# Altium schematic sheet Sheet3.SchDoc
size 420 x 297 mm; SheetNumber: 2; SheetTotal: 2; Razrabotal: {Разработал}; Prov: {Проверил}; Tkont: {Т. конт.}; Nkont: {Н. конт.}; Utv: {Утвердил}; Naimenovanie: {Наименование}; Oboznachenie: {Обозначение}; Shifr: {Шифр}
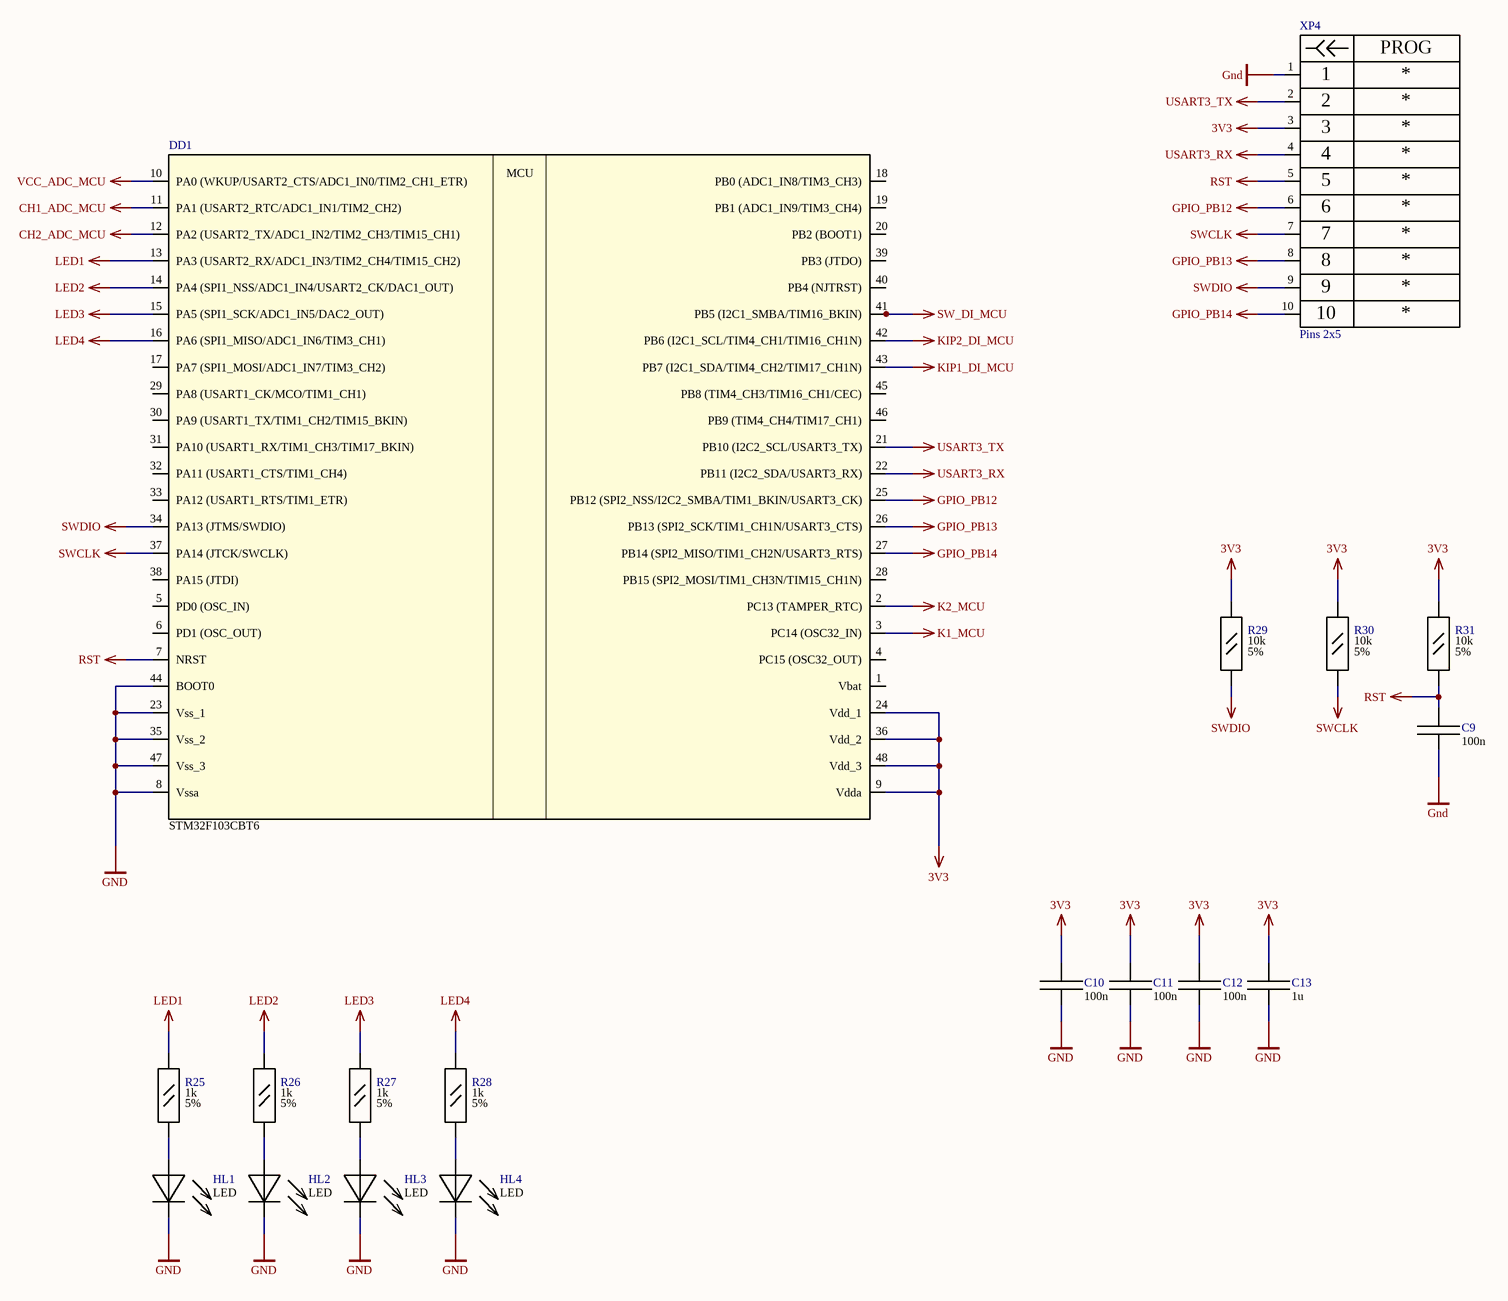
[diagram p0: Sheet3.SchDoc]

## Parts
C9  100n  [Cap Ceramic 0805]
C10  100n  [Cap Ceramic 0805]
C11  100n  [Cap Ceramic 0805]
C12  100n  [Cap Ceramic 0805]
C13  1u  [Cap Ceramic 0805]
DD1  STM32F103CBT6  [TQFP48/QFN48 S0.5]
HL1  LED  [LED S2.54d3.0]
HL2  LED  [LED S2.54d3.0]
HL3  LED  [LED S2.54d3.0]
HL4  LED  [LED S2.54d3.0]
R25  1k  Comments: 5%  [Resistor 0805]
R26  1k  Comments: 5%  [Resistor 0805]
R27  1k  Comments: 5%  [Resistor 0805]
R28  1k  Comments: 5%  [Resistor 0805]
R29  10k  Comments: 5%  [Resistor 0805]
R30  10k  Comments: 5%  [Resistor 0805]
R31  10k  Comments: 5%  [Resistor 0805]
XP4  Pins 2x5  Name: PROG  [Pins 2x5 - 1.27]

## Nets
3V3: C10.2 C11.2 C12.2 C13.2 DD1.9(Vdda) DD1.24(Vdd_1) DD1.36(Vdd_2) DD1.48(Vdd_3) R29.1 R30.1 R31.1 XP4.3
CH1_ADC_MCU: DD1.11(PA1_(USART2_RTC/ADC1_IN1/TIM2_CH2))
CH2_ADC_MCU: DD1.12(PA2_(USART2_TX/ADC1_IN2/TIM2_CH3/TIM15_CH1))
GND: C9.1 C10.1 C11.1 C12.1 C13.1 DD1.8(Vssa) DD1.23(Vss_1) DD1.35(Vss_2) DD1.44(BOOT0) DD1.47(Vss_3) HL1.2(K) HL2.2(K) HL3.2(K) HL4.2(K) XP4.1
GPIO_PB12: DD1.25(PB12_(SPI2_NSS/I2C2_SMBA/TIM1_BKIN/USART3_CK)) XP4.6
GPIO_PB13: DD1.26(PB13_(SPI2_SCK/TIM1_CH1N/USART3_CTS)) XP4.8
GPIO_PB14: DD1.27(PB14_(SPI2_MISO/TIM1_CH2N/USART3_RTS)) XP4.10
K1_MCU: DD1.3(PC14_(OSC32_IN))
K2_MCU: DD1.2(PC13_(TAMPER_RTC))
KIP1_DI_MCU: DD1.43(PB7_(I2C1_SDA/TIM4_CH2/TIM17_CH1N))
KIP2_DI_MCU: DD1.42(PB6_(I2C1_SCL/TIM4_CH1/TIM16_CH1N))
LED1: DD1.13(PA3_(USART2_RX/ADC1_IN3/TIM2_CH4/TIM15_CH2)) R25.1
LED2: DD1.14(PA4_(SPI1_NSS/ADC1_IN4/USART2_CK/DAC1_OUT)) R26.1
LED3: DD1.15(PA5_(SPI1_SCK/ADC1_IN5/DAC2_OUT)) R27.1
LED4: DD1.16(PA6_(SPI1_MISO/ADC1_IN6/TIM3_CH1)) R28.1
RST: C9.2 DD1.7(NRST) R31.2 XP4.5
SW_DI_MCU: DD1.41(PB5_(I2C1_SMBA/TIM16_BKIN))
SWCLK: DD1.37(PA14_(JTCK/SWCLK)) R30.2 XP4.7
SWDIO: DD1.34(PA13_(JTMS/SWDIO)) R29.2 XP4.9
USART3_RX: DD1.22(PB11_(I2C2_SDA/USART3_RX)) XP4.4
USART3_TX: DD1.21(PB10_(I2C2_SCL/USART3_TX)) XP4.2
VCC_ADC_MCU: DD1.10(PA0_(WKUP/USART2_CTS/ADC1_IN0/TIM2_CH1_ETR))
NetHL1_1: HL1.1(A) R25.2
NetHL2_1: HL2.1(A) R26.2
NetHL3_1: HL3.1(A) R27.2
NetHL4_1: HL4.1(A) R28.2

Not connected (* = marked no-connect by the designer): DD1 1(Vbat) 4(PC15_(OSC32_OUT)) 5(PD0_(OSC_IN)) 6(PD1_(OSC_OUT)) 17(PA7_(SPI1_MOSI/ADC1_IN7/TIM3_CH2)) 18(PB0_(ADC1_IN8/TIM3_CH3)) 19(PB1_(ADC1_IN9/TIM3_CH4)) 20(PB2_(BOOT1)) 28(PB15_(SPI2_MOSI/TIM1_CH3N/TIM15_CH1N)) 29(PA8_(USART1_CK/MCO/TIM1_CH1)) 30(PA9_(USART1_TX/TIM1_CH2/TIM15_BKIN)) 31(PA10_(USART1_RX/TIM1_CH3/TIM17_BKIN)) 32(PA11_(USART1_CTS/TIM1_CH4)) 33(PA12_(USART1_RTS/TIM1_ETR)) 38(PA15_(JTDI)) 39(PB3_(JTDO)) 40(PB4_(NJTRST)) 45(PB8_(TIM4_CH3/TIM16_CH1/CEC)) 46(PB9_(TIM4_CH4/TIM17_CH1))

## Notes on the sheet
- Перв. примен.
- Спра. №
- Подп. и дата
- Инв. № бубл.
- Взам. инв. №
- Инв. № подл.
- Лист
- Изм
- № докум.
- Подпись
- Дата
- Копировал
- Формат А3
- (in symbol STM32F100C4T6) MCU

## Library data of the parts
C9-C13 = CerCap: Comments: *
DD1 = STM32F100C4T6
R25-R31 = Resistor 0,125W
HL1-HL4 = LED: Comments: *
XP4 = Pins 2x5: Comments: *; Name1: *; Name2: *; Name3: *; Name4: *; Name5: *; Name6: *; Name7: *; Name8: *; Name9: *; Name10: *